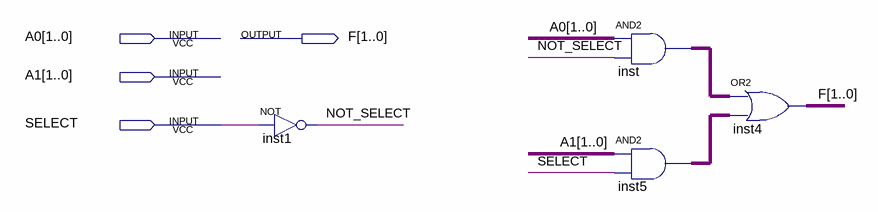
[diagram p0: schematic sheet]
// Quartus schematic MPX2_2.bdf as structural Verilog: 4 symbols, 4 pins
module MPX2_2 (
  input  [1:0] A0,
  input  [1:0] A1,
  input  SELECT,
  output [1:0] F
);

  wire NOT_SELECT;
  wire [1:0] inst5_out, inst_out;

  not inst1 (NOT_SELECT, SELECT);
  assign inst_out = A0 & {2{NOT_SELECT}};  // AND2 inst, 2 bits wide
  assign inst5_out = A1 & {2{SELECT}};  // AND2 inst5, 2 bits wide
  assign F = inst_out | inst5_out;  // OR2 inst4, 2 bits wide
endmodule
